# Altium schematic sheet Top Sheet.SchDoc: MIXR Input & Processing - Top Sheet
size C; Organization: Midnight Sun Solar Rayce Car Team; Address1: University of Waterloo; Address2: 200 University Ave W; Address3: Waterloo, ON, Canada; Address4: N2L 3E9; DocumentNumber: 2; SheetNumber: 2; SheetTotal: 15; Website: www.uwmidsun.com; ProjectName: ProjectName
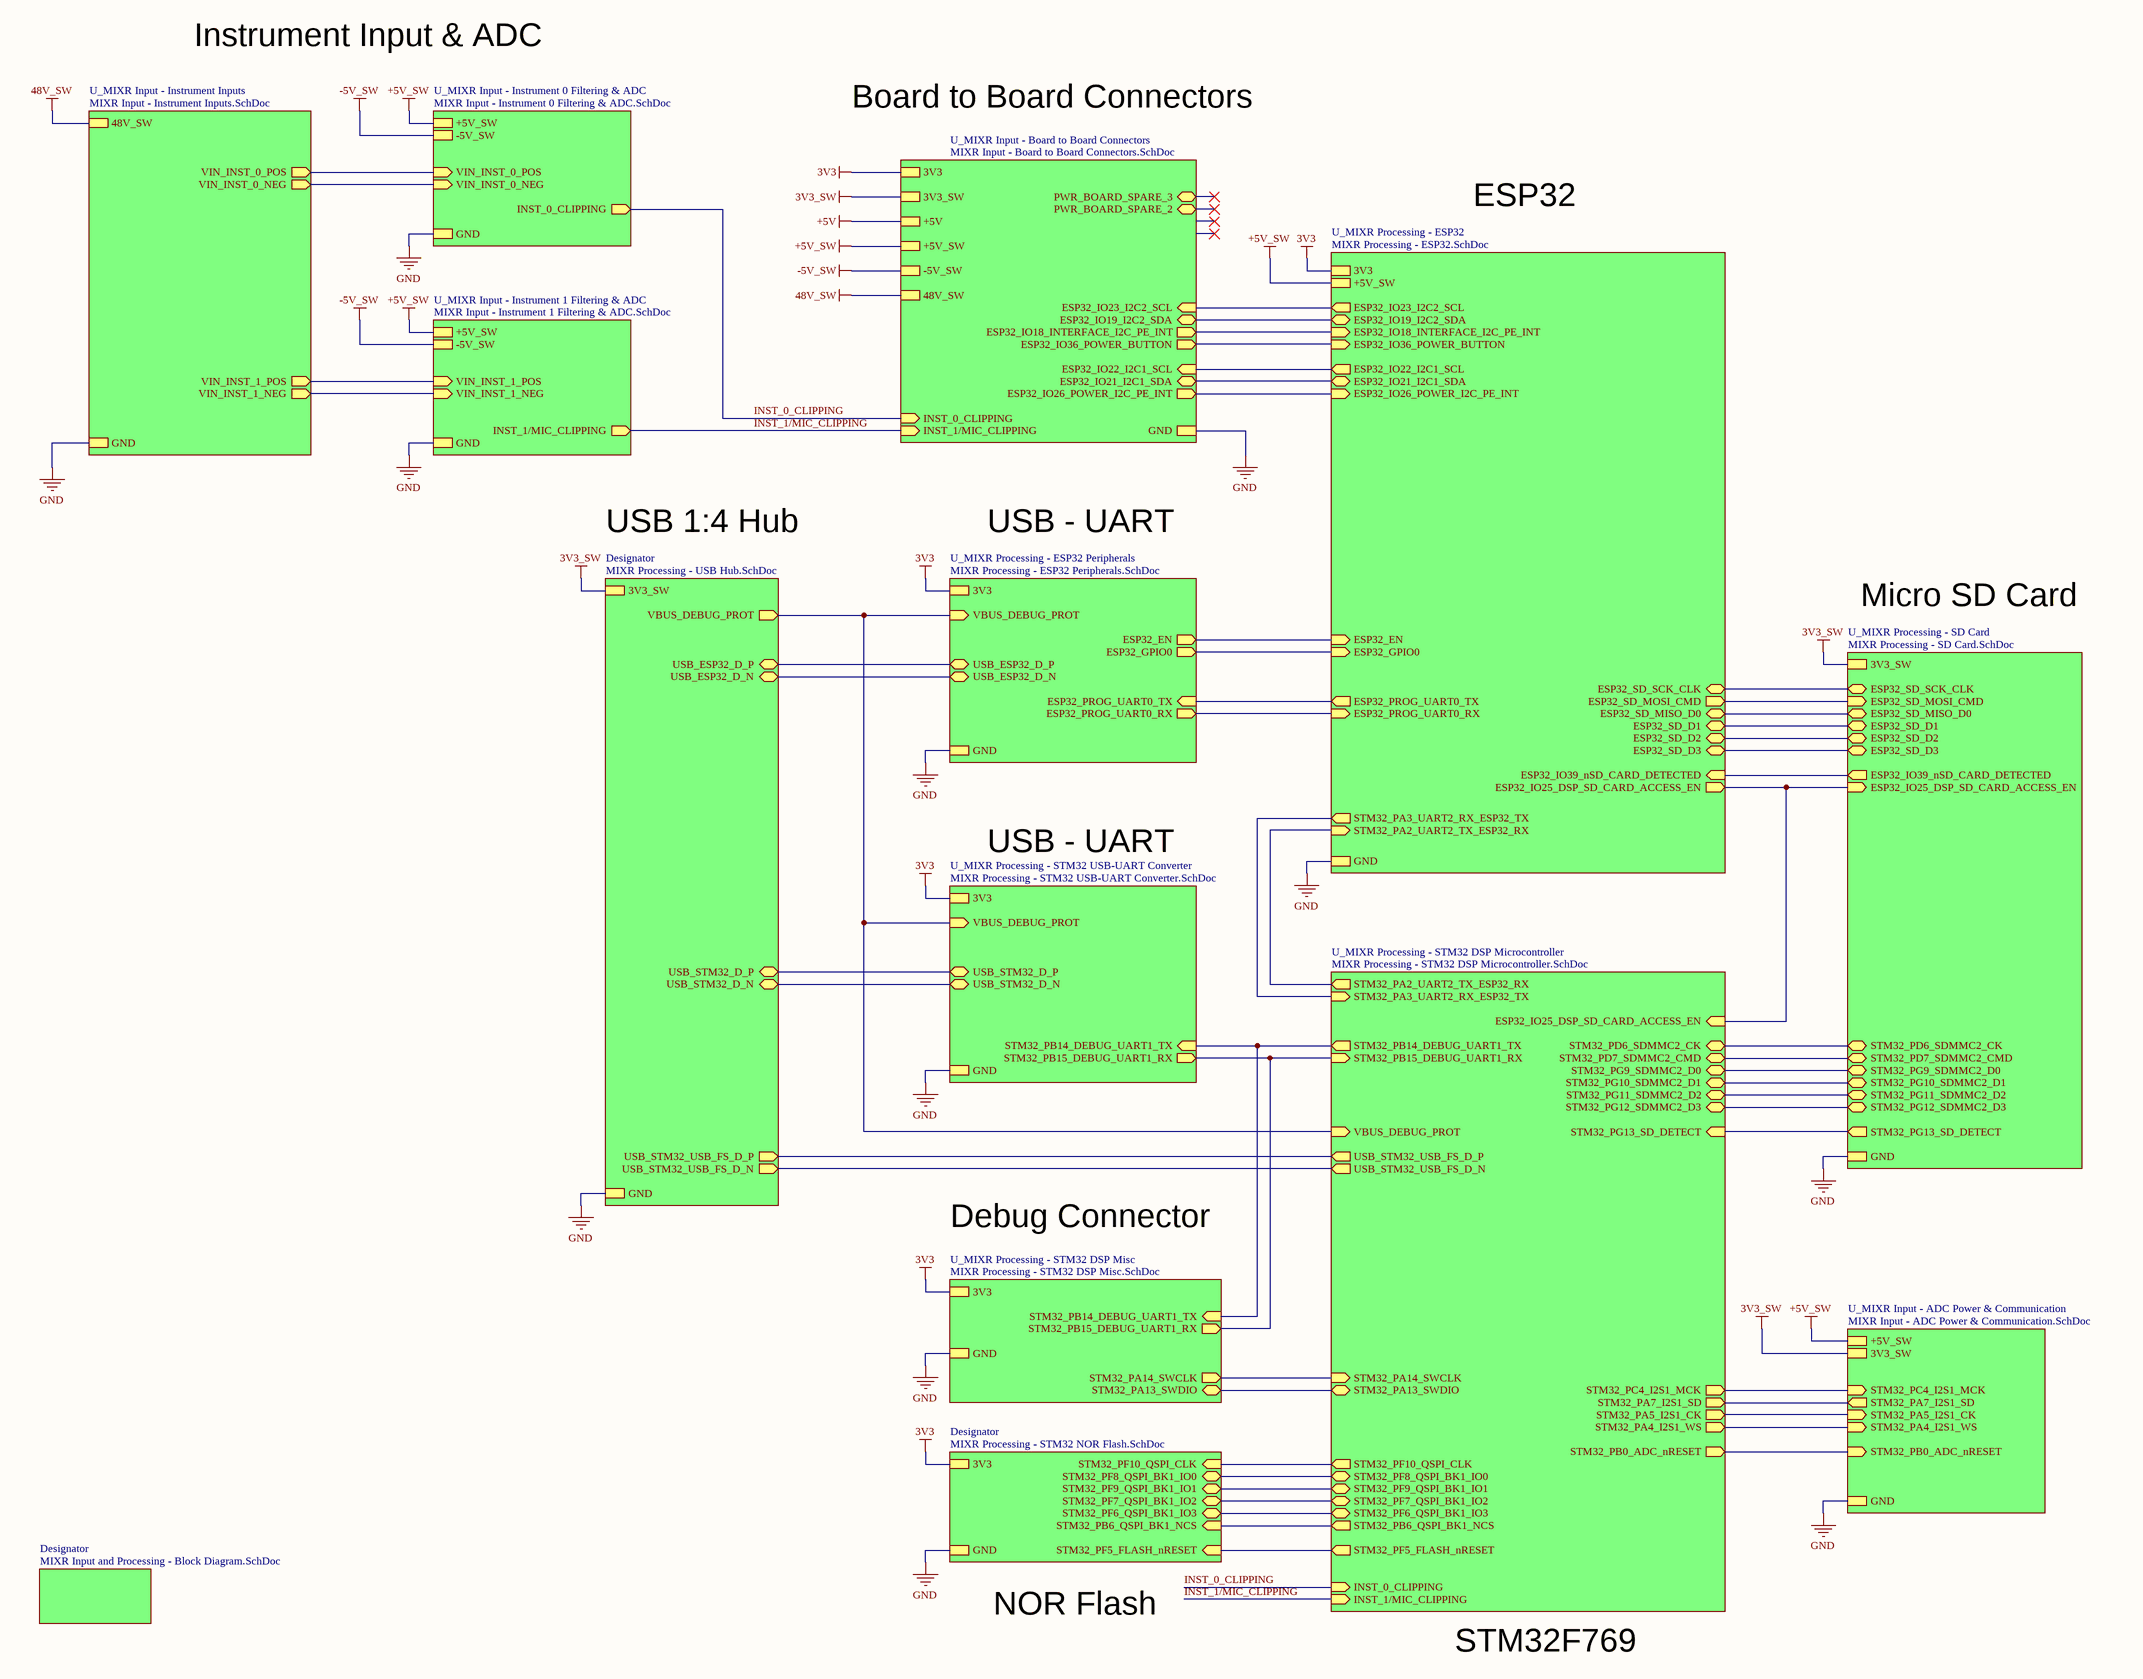
[diagram p0: Top Sheet.SchDoc]

## Sub-sheets
Designator = MIXR Processing - USB Hub.SchDoc: USB_STM32_D_P (bidir), USB_STM32_D_N (bidir), USB_ESP32_D_N (bidir), USB_STM32_USB_FS_D_N (out), USB_STM32_USB_FS_D_P (out), USB_ESP32_D_P (bidir), GND, VBUS_DEBUG_PROT (out), 3V3_SW
Designator = MIXR Processing - STM32 NOR Flash.SchDoc: STM32_PF6_QSPI_BK1_IO3 (bidir), STM32_PF7_QSPI_BK1_IO2 (bidir), GND, STM32_PF5_FLASH_nRESET (in), STM32_PF10_QSPI_CLK (in), 3V3, STM32_PF8_QSPI_BK1_IO0 (bidir), STM32_PF9_QSPI_BK1_IO1 (bidir), STM32_PB6_QSPI_BK1_NCS (in)
Designator = MIXR Input and Processing - Block Diagram.SchDoc: no entries
U_MIXR Input - ADC Power & Communication = MIXR Input - ADC Power & Communication.SchDoc: STM32_PC4_I2S1_MCK (in), STM32_PA7_I2S1_SD (out), STM32_PA5_I2S1_CK (in), STM32_PA4_I2S1_WS (in), +5V_SW, 3V3_SW, GND, STM32_PB0_ADC_nRESET (in)  | Name: ADC
U_MIXR Input - Board to Board Connectors = MIXR Input - Board to Board Connectors.SchDoc: GND, ESP32_IO21_I2C1_SDA (bidir), 3V3, +5V, -5V_SW, 3V3_SW, +5V_SW, 48V_SW, PWR_BOARD_SPARE_2 (bidir), PWR_BOARD_SPARE_3 (bidir), ESP32_IO22_I2C1_SCL (in), ESP32_IO26_POWER_I2C_PE_INT (out), ESP32_IO19_I2C2_SDA (bidir), ESP32_IO18_INTERFACE_I2C_PE_INT (out), ESP32_IO36_POWER_BUTTON (out), ESP32_IO23_I2C2_SCL (in), INST_1/MIC_CLIPPING (in), INST_0_CLIPPING (in)  | Name: PWR BOARD
U_MIXR Input - Instrument 0 Filtering & ADC = MIXR Input - Instrument 0 Filtering & ADC.SchDoc: VIN_INST_0_POS (in), VIN_INST_0_NEG (in), INST_0_CLIPPING (out), GND, -5V_SW, +5V_SW
U_MIXR Input - Instrument 1 Filtering & ADC = MIXR Input - Instrument 1 Filtering & ADC.SchDoc: VIN_INST_1_POS (in), VIN_INST_1_NEG (in), INST_1/MIC_CLIPPING (out), GND, -5V_SW, +5V_SW
U_MIXR Input - Instrument Inputs = MIXR Input - Instrument Inputs.SchDoc: VIN_INST_0_POS (out), VIN_INST_0_NEG (out), VIN_INST_1_POS (out), VIN_INST_1_NEG (out), 48V_SW, GND
U_MIXR Processing - ESP32 = MIXR Processing - ESP32.SchDoc: ESP32_SD_SCK_CLK (bidir), ESP32_SD_MOSI_CMD (out), ESP32_SD_MISO_D0 (bidir), ESP32_SD_D1 (bidir), ESP32_SD_D3 (bidir), ESP32_EN (in), ESP32_GPIO0 (in), ESP32_PROG_UART0_TX (out), ESP32_PROG_UART0_RX (in), ESP32_IO19_I2C2_SDA (bidir), ESP32_IO23_I2C2_SCL (out), ESP32_IO39_nSD_CARD_DETECTED (in), ESP32_IO36_POWER_BUTTON (in), ESP32_IO25_DSP_SD_CARD_ACCESS_EN (out), ESP32_IO21_I2C1_SDA (bidir), ESP32_IO22_I2C1_SCL (out), ESP32_SD_D2 (bidir), ESP32_IO26_POWER_I2C_PE_INT (in), 3V3, GND, STM32_PA2_UART2_TX_ESP32_RX (in), STM32_PA3_UART2_RX_ESP32_TX (out), ESP32_IO18_INTERFACE_I2C_PE_INT (in), +5V_SW  | Name: ESP32
U_MIXR Processing - ESP32 Peripherals = MIXR Processing - ESP32 Peripherals.SchDoc: USB_ESP32_D_P (bidir), USB_ESP32_D_N (bidir), ESP32_EN (out), ESP32_GPIO0 (out), ESP32_PROG_UART0_TX (in), ESP32_PROG_UART0_RX (out), 3V3, GND, VBUS_DEBUG_PROT (in)
U_MIXR Processing - SD Card = MIXR Processing - SD Card.SchDoc: ESP32_SD_SCK_CLK (bidir), ESP32_SD_MOSI_CMD (in), ESP32_SD_MISO_D0 (bidir), ESP32_SD_D1 (bidir), ESP32_SD_D2 (bidir), ESP32_SD_D3 (bidir), ESP32_IO39_nSD_CARD_DETECTED (out), STM32_PG11_SDMMC2_D2 (bidir), STM32_PG12_SDMMC2_D3 (bidir), STM32_PD6_SDMMC2_CK (bidir), STM32_PD7_SDMMC2_CMD (bidir), STM32_PG13_SD_DETECT (out), STM32_PG10_SDMMC2_D1 (bidir), STM32_PG9_SDMMC2_D0 (bidir), GND, 3V3_SW, ESP32_IO25_DSP_SD_CARD_ACCESS_EN (in)  | Name: SD Card
U_MIXR Processing - STM32 DSP Microcontroller = MIXR Processing - STM32 DSP Microcontroller.SchDoc: STM32_PG11_SDMMC2_D2 (bidir), STM32_PG12_SDMMC2_D3 (bidir), STM32_PG10_SDMMC2_D1 (bidir), STM32_PG9_SDMMC2_D0 (bidir), STM32_PD6_SDMMC2_CK (bidir), STM32_PD7_SDMMC2_CMD (bidir), STM32_PC4_I2S1_MCK (out), STM32_PA7_I2S1_SD (out), STM32_PA5_I2S1_CK (out), STM32_PA4_I2S1_WS (out), STM32_PB14_DEBUG_UART1_TX (out), STM32_PB15_DEBUG_UART1_RX (in), USB_STM32_USB_FS_D_P (out), USB_STM32_USB_FS_D_N (out), STM32_PG13_SD_DETECT (in), STM32_PA14_SWCLK (in), STM32_PA13_SWDIO (bidir), VBUS_DEBUG_PROT (in), STM32_PB0_ADC_nRESET (out), STM32_PA2_UART2_TX_ESP32_RX (out), STM32_PA3_UART2_RX_ESP32_TX (in), ESP32_IO25_DSP_SD_CARD_ACCESS_EN (in), INST_0_CLIPPING (in), INST_1/MIC_CLIPPING (in), STM32_PF7_QSPI_BK1_IO2 (bidir), STM32_PF8_QSPI_BK1_IO0 (bidir), STM32_PF6_QSPI_BK1_IO3 (bidir), STM32_PF9_QSPI_BK1_IO1 (bidir), STM32_PF10_QSPI_CLK (out), STM32_PB6_QSPI_BK1_NCS (out), STM32_PF5_FLASH_nRESET (out)
U_MIXR Processing - STM32 DSP Misc = MIXR Processing - STM32 DSP Misc.SchDoc: 3V3, STM32_PA13_SWDIO (bidir), STM32_PA14_SWCLK (out), STM32_PB15_DEBUG_UART1_RX (out), STM32_PB14_DEBUG_UART1_TX (in), GND
U_MIXR Processing - STM32 USB-UART Converter = MIXR Processing - STM32 USB-UART Converter.SchDoc: USB_STM32_D_P (bidir), USB_STM32_D_N (bidir), STM32_PB14_DEBUG_UART1_TX (in), STM32_PB15_DEBUG_UART1_RX (out), 3V3, GND, VBUS_DEBUG_PROT (in)

## Nets
3V3: sheet U_MIXR Processing - STM32 USB-UART Converter/3V3, sheet U_MIXR Processing - ESP32/3V3, sheet U_MIXR Processing - ESP32 Peripherals/3V3, sheet U_MIXR Processing - STM32 DSP Misc/3V3, sheet U_MIXR Input - Board to Board Connectors/3V3, sheet Designator/3V3
3V3_SW: sheet Designator/3V3_SW, sheet U_MIXR Processing - SD Card/3V3_SW, sheet U_MIXR Input - ADC Power & Communication/3V3_SW, sheet U_MIXR Input - Board to Board Connectors/3V3_SW
48V_SW: sheet U_MIXR Input - Instrument Inputs/48V_SW, sheet U_MIXR Input - Board to Board Connectors/48V_SW
+5V: sheet U_MIXR Input - Board to Board Connectors/+5V
+5V_SW: sheet U_MIXR Processing - ESP32/+5V_SW, sheet U_MIXR Input - Instrument 1 Filtering & ADC/+5V_SW, sheet U_MIXR Input - Instrument 0 Filtering & ADC/+5V_SW, sheet U_MIXR Input - ADC Power & Communication/+5V_SW, sheet U_MIXR Input - Board to Board Connectors/+5V_SW
-5V_SW: sheet U_MIXR Input - Instrument 1 Filtering & ADC/-5V_SW, sheet U_MIXR Input - Instrument 0 Filtering & ADC/-5V_SW, sheet U_MIXR Input - Board to Board Connectors/-5V_SW
GND: sheet Designator/GND, sheet U_MIXR Processing - STM32 USB-UART Converter/GND, sheet U_MIXR Processing - SD Card/GND, sheet U_MIXR Processing - ESP32/GND, sheet U_MIXR Processing - ESP32 Peripherals/GND, sheet U_MIXR Input - Instrument Inputs/GND, sheet U_MIXR Input - Instrument 1 Filtering & ADC/GND, sheet U_MIXR Input - Instrument 0 Filtering & ADC/GND, sheet U_MIXR Input - ADC Power & Communication/GND, sheet U_MIXR Processing - STM32 DSP Misc/GND, sheet U_MIXR Input - Board to Board Connectors/GND, sheet Designator/GND
INST_0_CLIPPING: sheet U_MIXR Processing - STM32 DSP Microcontroller/INST_0_CLIPPING, sheet U_MIXR Input - Instrument 0 Filtering & ADC/INST_0_CLIPPING, sheet U_MIXR Input - Board to Board Connectors/INST_0_CLIPPING
INST_1/MIC_CLIPPING: sheet U_MIXR Processing - STM32 DSP Microcontroller/INST_1/MIC_CLIPPING, sheet U_MIXR Input - Instrument 1 Filtering & ADC/INST_1/MIC_CLIPPING, sheet U_MIXR Input - Board to Board Connectors/INST_1/MIC_CLIPPING
(unnamed): sheet Designator/USB_STM32_D_P, sheet U_MIXR Processing - STM32 USB-UART Converter/USB_STM32_D_P
(unnamed): sheet Designator/USB_STM32_D_N, sheet U_MIXR Processing - STM32 USB-UART Converter/USB_STM32_D_N
(unnamed): sheet Designator/USB_ESP32_D_N, sheet U_MIXR Processing - ESP32 Peripherals/USB_ESP32_D_N
(unnamed): sheet Designator/USB_STM32_USB_FS_D_N, sheet U_MIXR Processing - STM32 DSP Microcontroller/USB_STM32_USB_FS_D_N
(unnamed): sheet Designator/USB_STM32_USB_FS_D_P, sheet U_MIXR Processing - STM32 DSP Microcontroller/USB_STM32_USB_FS_D_P
(unnamed): sheet Designator/USB_ESP32_D_P, sheet U_MIXR Processing - ESP32 Peripherals/USB_ESP32_D_P
(unnamed): sheet Designator/VBUS_DEBUG_PROT, sheet U_MIXR Processing - STM32 USB-UART Converter/VBUS_DEBUG_PROT, sheet U_MIXR Processing - STM32 DSP Microcontroller/VBUS_DEBUG_PROT, sheet U_MIXR Processing - ESP32 Peripherals/VBUS_DEBUG_PROT
(unnamed): sheet U_MIXR Processing - STM32 USB-UART Converter/STM32_PB14_DEBUG_UART1_TX, sheet U_MIXR Processing - STM32 DSP Microcontroller/STM32_PB14_DEBUG_UART1_TX, sheet U_MIXR Processing - STM32 DSP Misc/STM32_PB14_DEBUG_UART1_TX
(unnamed): sheet U_MIXR Processing - STM32 USB-UART Converter/STM32_PB15_DEBUG_UART1_RX, sheet U_MIXR Processing - STM32 DSP Microcontroller/STM32_PB15_DEBUG_UART1_RX, sheet U_MIXR Processing - STM32 DSP Misc/STM32_PB15_DEBUG_UART1_RX
(unnamed): sheet U_MIXR Processing - STM32 DSP Microcontroller/STM32_PG11_SDMMC2_D2, sheet U_MIXR Processing - SD Card/STM32_PG11_SDMMC2_D2
(unnamed): sheet U_MIXR Processing - STM32 DSP Microcontroller/STM32_PG12_SDMMC2_D3, sheet U_MIXR Processing - SD Card/STM32_PG12_SDMMC2_D3
(unnamed): sheet U_MIXR Processing - STM32 DSP Microcontroller/STM32_PG10_SDMMC2_D1, sheet U_MIXR Processing - SD Card/STM32_PG10_SDMMC2_D1
(unnamed): sheet U_MIXR Processing - STM32 DSP Microcontroller/STM32_PG9_SDMMC2_D0, sheet U_MIXR Processing - SD Card/STM32_PG9_SDMMC2_D0
(unnamed): sheet U_MIXR Processing - STM32 DSP Microcontroller/STM32_PD6_SDMMC2_CK, sheet U_MIXR Processing - SD Card/STM32_PD6_SDMMC2_CK
(unnamed): sheet U_MIXR Processing - STM32 DSP Microcontroller/STM32_PD7_SDMMC2_CMD, sheet U_MIXR Processing - SD Card/STM32_PD7_SDMMC2_CMD
(unnamed): sheet U_MIXR Processing - STM32 DSP Microcontroller/STM32_PC4_I2S1_MCK, sheet U_MIXR Input - ADC Power & Communication/STM32_PC4_I2S1_MCK
(unnamed): sheet U_MIXR Processing - STM32 DSP Microcontroller/STM32_PA7_I2S1_SD, sheet U_MIXR Input - ADC Power & Communication/STM32_PA7_I2S1_SD
(unnamed): sheet U_MIXR Processing - STM32 DSP Microcontroller/STM32_PA5_I2S1_CK, sheet U_MIXR Input - ADC Power & Communication/STM32_PA5_I2S1_CK
(unnamed): sheet U_MIXR Processing - STM32 DSP Microcontroller/STM32_PA4_I2S1_WS, sheet U_MIXR Input - ADC Power & Communication/STM32_PA4_I2S1_WS
(unnamed): sheet U_MIXR Processing - STM32 DSP Microcontroller/STM32_PG13_SD_DETECT, sheet U_MIXR Processing - SD Card/STM32_PG13_SD_DETECT
(unnamed): sheet U_MIXR Processing - STM32 DSP Microcontroller/STM32_PA14_SWCLK, sheet U_MIXR Processing - STM32 DSP Misc/STM32_PA14_SWCLK
(unnamed): sheet U_MIXR Processing - STM32 DSP Microcontroller/STM32_PA13_SWDIO, sheet U_MIXR Processing - STM32 DSP Misc/STM32_PA13_SWDIO
(unnamed): sheet U_MIXR Processing - STM32 DSP Microcontroller/STM32_PB0_ADC_nRESET, sheet U_MIXR Input - ADC Power & Communication/STM32_PB0_ADC_nRESET
(unnamed): sheet U_MIXR Processing - STM32 DSP Microcontroller/STM32_PA2_UART2_TX_ESP32_RX, sheet U_MIXR Processing - ESP32/STM32_PA2_UART2_TX_ESP32_RX
(unnamed): sheet U_MIXR Processing - STM32 DSP Microcontroller/STM32_PA3_UART2_RX_ESP32_TX, sheet U_MIXR Processing - ESP32/STM32_PA3_UART2_RX_ESP32_TX
(unnamed): sheet U_MIXR Processing - STM32 DSP Microcontroller/ESP32_IO25_DSP_SD_CARD_ACCESS_EN, sheet U_MIXR Processing - SD Card/ESP32_IO25_DSP_SD_CARD_ACCESS_EN, sheet U_MIXR Processing - ESP32/ESP32_IO25_DSP_SD_CARD_ACCESS_EN
(unnamed): sheet U_MIXR Processing - STM32 DSP Microcontroller/STM32_PF7_QSPI_BK1_IO2, sheet Designator/STM32_PF7_QSPI_BK1_IO2
(unnamed): sheet U_MIXR Processing - STM32 DSP Microcontroller/STM32_PF8_QSPI_BK1_IO0, sheet Designator/STM32_PF8_QSPI_BK1_IO0
(unnamed): sheet U_MIXR Processing - STM32 DSP Microcontroller/STM32_PF6_QSPI_BK1_IO3, sheet Designator/STM32_PF6_QSPI_BK1_IO3
(unnamed): sheet U_MIXR Processing - STM32 DSP Microcontroller/STM32_PF9_QSPI_BK1_IO1, sheet Designator/STM32_PF9_QSPI_BK1_IO1
(unnamed): sheet U_MIXR Processing - STM32 DSP Microcontroller/STM32_PF10_QSPI_CLK, sheet Designator/STM32_PF10_QSPI_CLK
(unnamed): sheet U_MIXR Processing - STM32 DSP Microcontroller/STM32_PB6_QSPI_BK1_NCS, sheet Designator/STM32_PB6_QSPI_BK1_NCS
(unnamed): sheet U_MIXR Processing - STM32 DSP Microcontroller/STM32_PF5_FLASH_nRESET, sheet Designator/STM32_PF5_FLASH_nRESET
(unnamed): sheet U_MIXR Processing - SD Card/ESP32_SD_SCK_CLK, sheet U_MIXR Processing - ESP32/ESP32_SD_SCK_CLK
(unnamed): sheet U_MIXR Processing - SD Card/ESP32_SD_MOSI_CMD, sheet U_MIXR Processing - ESP32/ESP32_SD_MOSI_CMD
(unnamed): sheet U_MIXR Processing - SD Card/ESP32_SD_MISO_D0, sheet U_MIXR Processing - ESP32/ESP32_SD_MISO_D0
(unnamed): sheet U_MIXR Processing - SD Card/ESP32_SD_D1, sheet U_MIXR Processing - ESP32/ESP32_SD_D1
(unnamed): sheet U_MIXR Processing - SD Card/ESP32_SD_D2, sheet U_MIXR Processing - ESP32/ESP32_SD_D2
(unnamed): sheet U_MIXR Processing - SD Card/ESP32_SD_D3, sheet U_MIXR Processing - ESP32/ESP32_SD_D3
(unnamed): sheet U_MIXR Processing - SD Card/ESP32_IO39_nSD_CARD_DETECTED, sheet U_MIXR Processing - ESP32/ESP32_IO39_nSD_CARD_DETECTED
(unnamed): sheet U_MIXR Processing - ESP32/ESP32_EN, sheet U_MIXR Processing - ESP32 Peripherals/ESP32_EN
(unnamed): sheet U_MIXR Processing - ESP32/ESP32_GPIO0, sheet U_MIXR Processing - ESP32 Peripherals/ESP32_GPIO0
(unnamed): sheet U_MIXR Processing - ESP32/ESP32_PROG_UART0_TX, sheet U_MIXR Processing - ESP32 Peripherals/ESP32_PROG_UART0_TX
(unnamed): sheet U_MIXR Processing - ESP32/ESP32_PROG_UART0_RX, sheet U_MIXR Processing - ESP32 Peripherals/ESP32_PROG_UART0_RX
(unnamed): sheet U_MIXR Processing - ESP32/ESP32_IO19_I2C2_SDA, sheet U_MIXR Input - Board to Board Connectors/ESP32_IO19_I2C2_SDA
(unnamed): sheet U_MIXR Processing - ESP32/ESP32_IO23_I2C2_SCL, sheet U_MIXR Input - Board to Board Connectors/ESP32_IO23_I2C2_SCL
(unnamed): sheet U_MIXR Processing - ESP32/ESP32_IO36_POWER_BUTTON, sheet U_MIXR Input - Board to Board Connectors/ESP32_IO36_POWER_BUTTON
(unnamed): sheet U_MIXR Processing - ESP32/ESP32_IO21_I2C1_SDA, sheet U_MIXR Input - Board to Board Connectors/ESP32_IO21_I2C1_SDA
(unnamed): sheet U_MIXR Processing - ESP32/ESP32_IO22_I2C1_SCL, sheet U_MIXR Input - Board to Board Connectors/ESP32_IO22_I2C1_SCL
(unnamed): sheet U_MIXR Processing - ESP32/ESP32_IO26_POWER_I2C_PE_INT, sheet U_MIXR Input - Board to Board Connectors/ESP32_IO26_POWER_I2C_PE_INT
(unnamed): sheet U_MIXR Processing - ESP32/ESP32_IO18_INTERFACE_I2C_PE_INT, sheet U_MIXR Input - Board to Board Connectors/ESP32_IO18_INTERFACE_I2C_PE_INT
(unnamed): sheet U_MIXR Input - Instrument Inputs/VIN_INST_0_POS, sheet U_MIXR Input - Instrument 0 Filtering & ADC/VIN_INST_0_POS
(unnamed): sheet U_MIXR Input - Instrument Inputs/VIN_INST_0_NEG, sheet U_MIXR Input - Instrument 0 Filtering & ADC/VIN_INST_0_NEG
(unnamed): sheet U_MIXR Input - Instrument Inputs/VIN_INST_1_POS, sheet U_MIXR Input - Instrument 1 Filtering & ADC/VIN_INST_1_POS
(unnamed): sheet U_MIXR Input - Instrument Inputs/VIN_INST_1_NEG, sheet U_MIXR Input - Instrument 1 Filtering & ADC/VIN_INST_1_NEG

## Notes on the sheet
- Instrument Input & ADC
- Board to Board Connectors
- ESP32
- USB 1:4 Hub
- USB - UART
- Micro SD Card
- Debug Connector
- NOR Flash
- STM32F769
- PROJECT
- DOCUMENT
- PART NUMBER
- VARIANT
- DRAWN BY
- LAST MODIFIED
- REVISION
- SHEET
- OF